# EasyEDA Pro project Twinverter_PB_MTE_3.eprj, schematic phase_current_sensor_sch
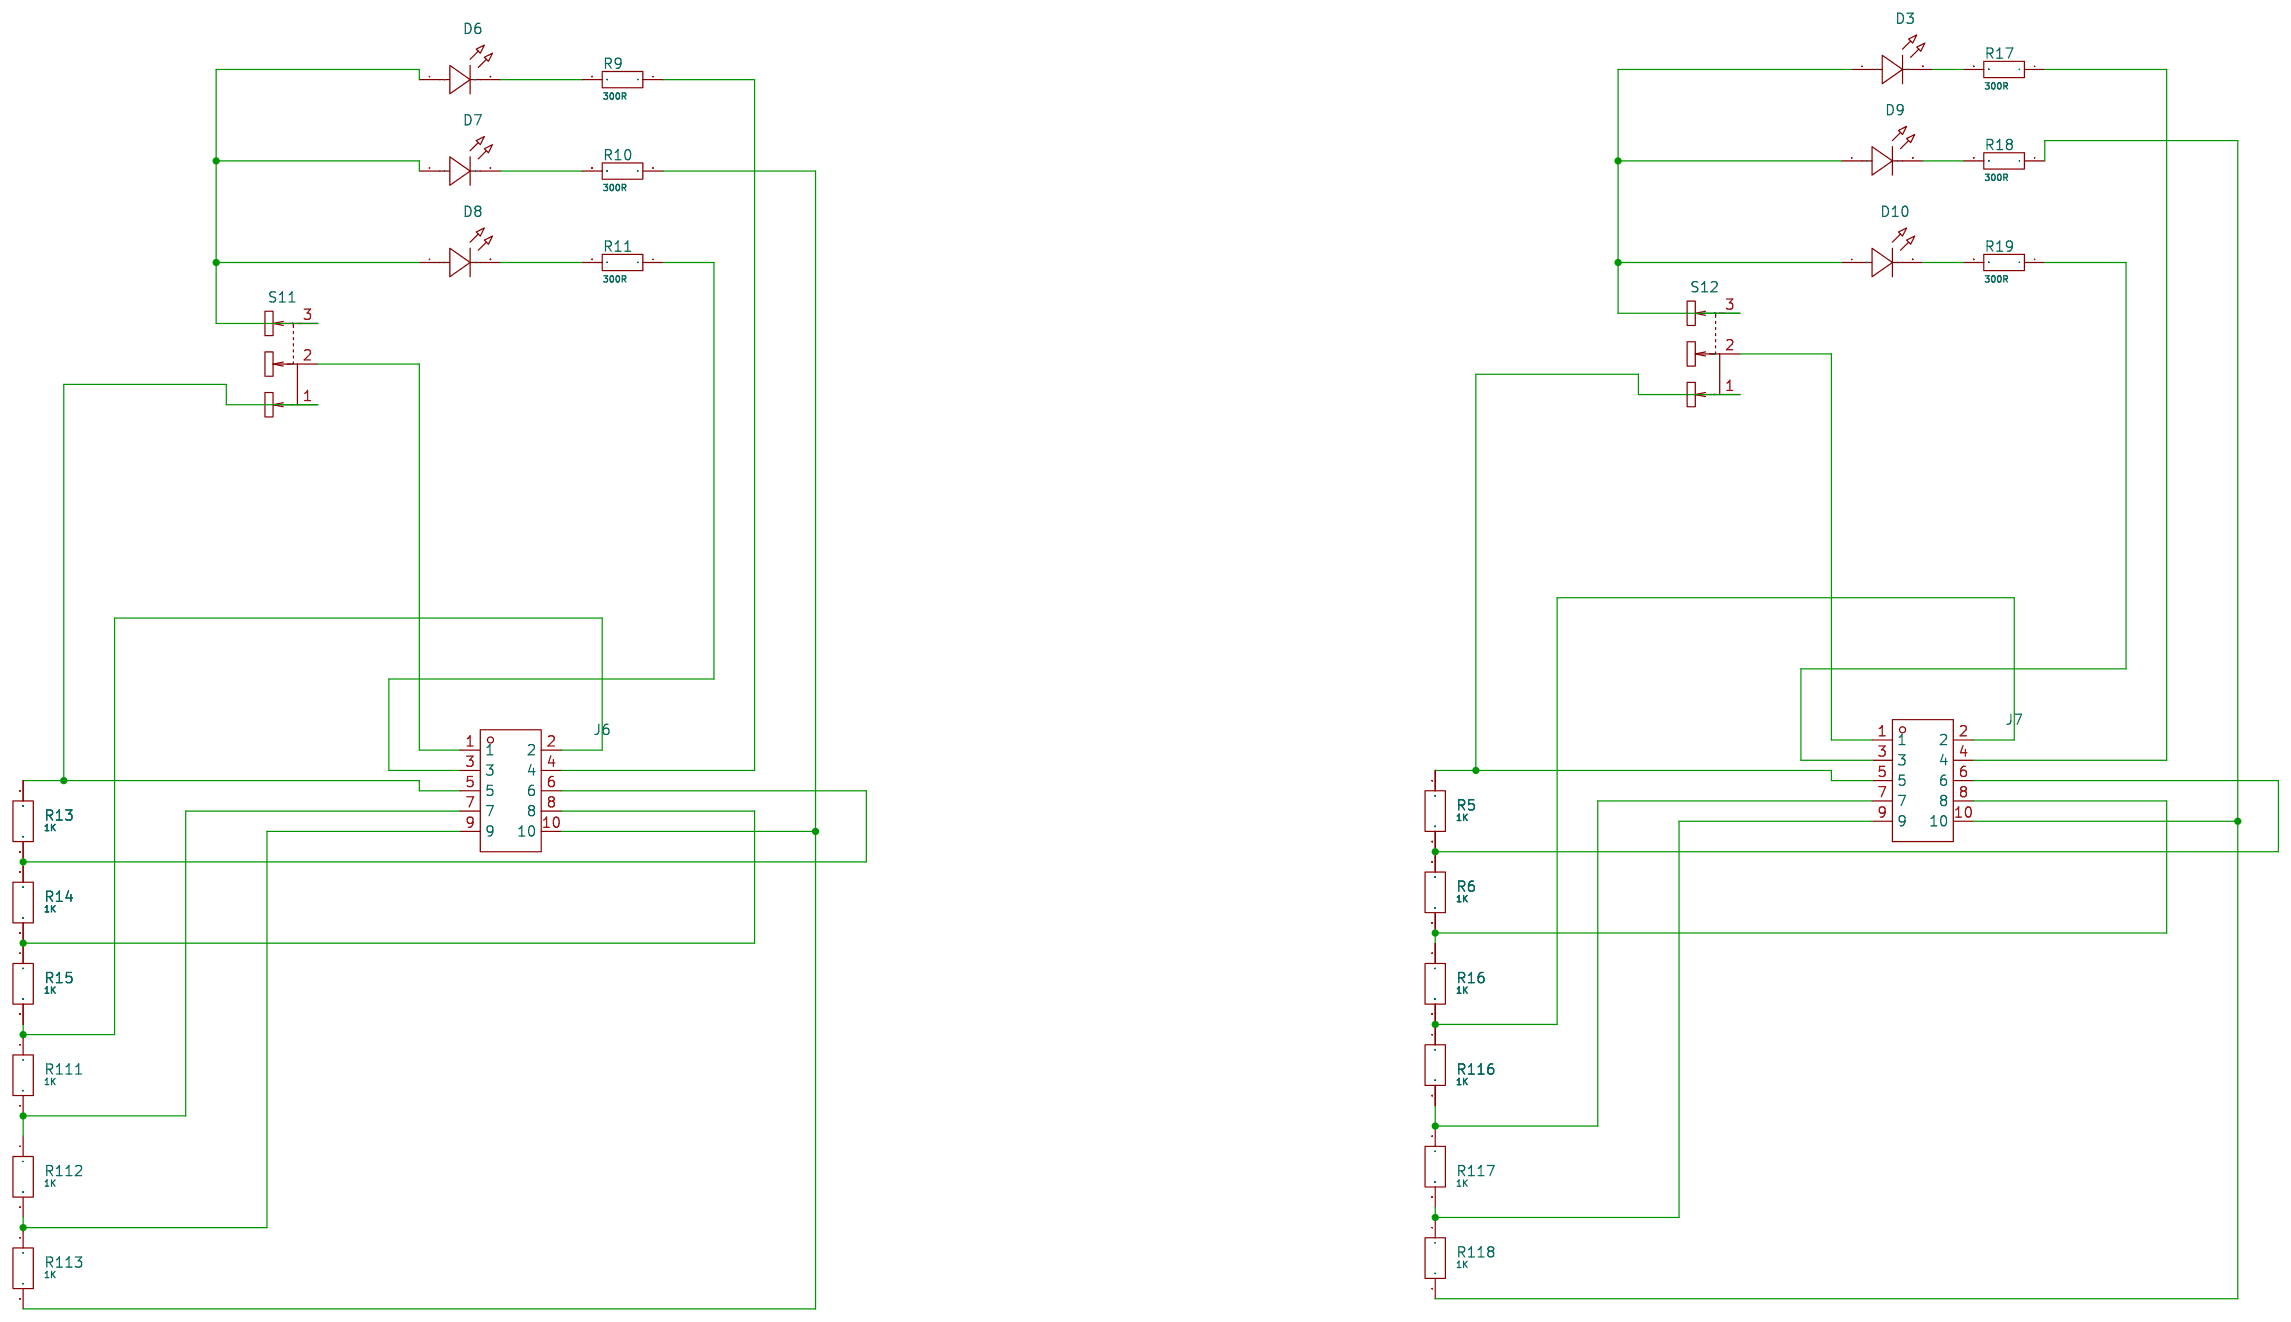
[diagram p1: schematic sheet]

## Parts
D3  XL-3216SURC  [LED1206-R-RD_RED]
D6  XL-3216SURC  [LED1206-R-RD_RED]
D7  XL-3216SURC  [LED1206-R-RD_RED]
D8  XL-3216SURC  [LED1206-R-RD_RED]
D9  XL-3216SURC  [LED1206-R-RD_RED]
D10  XL-3216SURC  [LED1206-R-RD_RED]
J6  TFML-105-02-S-D-A  [CONN-SMD_TFML-105-02-S-D-A]
J7  TFML-105-02-S-D-A  [CONN-SMD_TFML-105-02-S-D-A]
R5  1K  [Resistor_SMD:R_1206_3216Metric]
R6  1K  [Resistor_SMD:R_1206_3216Metric]
R9  300R  [Resistor_SMD:R_1206_3216Metric]
R10  300R  [Resistor_SMD:R_1206_3216Metric]
R11  300R  [Resistor_SMD:R_1206_3216Metric]
R13  1K  [Resistor_SMD:R_1206_3216Metric]
R14  1K  [Resistor_SMD:R_1206_3216Metric]
R15  1K  [Resistor_SMD:R_1206_3216Metric]
R16  1K  [Resistor_SMD:R_1206_3216Metric]
R17  300R  [Resistor_SMD:R_1206_3216Metric]
R18  300R  [Resistor_SMD:R_1206_3216Metric]
R19  300R  [Resistor_SMD:R_1206_3216Metric]
R111  1K  [Resistor_SMD:R_1206_3216Metric]
R112  1K  [Resistor_SMD:R_1206_3216Metric]
R113  1K  [Resistor_SMD:R_1206_3216Metric]
R116  1K  [Resistor_SMD:R_1206_3216Metric]
R117  1K  [Resistor_SMD:R_1206_3216Metric]
R118  1K  [Resistor_SMD:R_1206_3216Metric]
S11  JS102011JCQN  [SamacSys_Parts:JS102011JCQN]
S12  JS102011JCQN  [SamacSys_Parts:JS102011JCQN]

## Library data of the parts
D3 D6-D10 = XL-3216SURC: 发光颜色:红色;功率:55mW;正向电流:25mA;主波长:617nm~621nm;透镜颜色:无色透明透镜;色温:-;发光角度:120°;载带方式:正贴;工作温度:-30℃~+85℃;; Supplier Part: C965822; Manufacturer: XINGLIGHT(成兴光); Supplier Footprint: 1206; JLCPCB Part Class: Extended Part; Datasheet: https://atta.szlcsc.com/upload/public/pdf/source/20221102/38B682A5E5FDBBFCA7077B6272CE8E6F.pdf; Supplier: LCSC; Emitted Color: 红色; Power Dissipation: 55mW; Forward Current: 25mA; Dominant Wavelength: 617nm~621nm; Peak Wavelength: 623nm; Lens Color: 无色透明透镜; Viewing Angle: 120°; Mounting Sytle: 正贴; Operating Temperature: -30℃~+85℃
J6 J7 = TFML-105-02-S-D-A: Supplier Part: C17620614; Manufacturer: SAMTEC; Supplier Footprint: SMD; JLCPCB Part Class: Extended Part; Datasheet: https://atta.szlcsc.com/upload/public/pdf/source/231023/C17200826-8fd860b376dc57f4b81139fe7e44d820.pdf; Supplier: LCSC; Mounting Style: 立贴; Number of Rows: 2; Row Spacing: 1.27mm; Contact Material: 磷青铜; Contact Plating: 锡; Operating Temperature Range: -55℃~+125℃
R5 R6 R9-R11 R13-R19 R111-R113 R116-R118 = Device_R: Resistor; Users: REF**
S11 S12 = SamacSys_Parts_JS102011JCQN: Slide Switches .3A 6VDC SPDT VERT MNT SMT J BEND; Users: REF**; datasheet: https://www.ckswitches.com/media/1422/js.pdf; height: 3; manufacturer_name: C & K COMPONENTS; mouser part number: 611-JS102011JCQN; mouser price/stock: https://www.mouser.co.uk/ProductDetail/CK/JS102011JCQN?qs=74EMXstkWMWQs9mNwlyl0g%3D%3D; arrow price/stock: https://www.arrow.com/en/products/js102011jcqn/ck?utm_currency=USD&region=nac; User doc link: https://www.ckswitches.com/media/1422/js.pdf

## Nets
Net-(D3-1): D3.1(K) D9.1(K) D10.1(K) S12.3
Net-(D3-2): D3.2(A) R17.2
Net-(D6-1): D6.1(K) D7.1(K) D8.1(K) S11.3
Net-(D6-2): D6.2(A) R9.2
Net-(D7-2): D7.2(A) R10.2
Net-(D8-2): D8.2(A) R11.2
Net-(D9-2): D9.2(A) R18.2
Net-(D10-2): D10.2(A) R19.2
Net-(J6-1): J6.1 S11.2
Net-(J6-2): J6.2 R15.2 R111.1
Net-(J6-3): J6.3 R11.1
Net-(J6-4): J6.4 R9.1
Net-(J6-5): J6.5 R13.1 S11.1
Net-(J6-6): J6.6 R13.2 R14.1
Net-(J6-7): J6.7 R111.2 R112.1
Net-(J6-8): J6.8 R14.2 R15.1
Net-(J6-9): J6.9 R112.2 R113.1
Net-(J6-10): J6.10 R10.1 R113.2
Net-(J7-1): J7.1 S12.2
Net-(J7-2): J7.2 R16.2 R116.1
Net-(J7-3): J7.3 R19.1
Net-(J7-4): J7.4 R17.1
Net-(J7-5): J7.5 R5.1 S12.1
Net-(J7-6): J7.6 R5.2 R6.1
Net-(J7-7): J7.7 R116.2 R117.1
Net-(J7-8): J7.8 R6.2 R16.1
Net-(J7-9): J7.9 R117.2 R118.1
Net-(J7-10): J7.10 R18.1 R118.2
